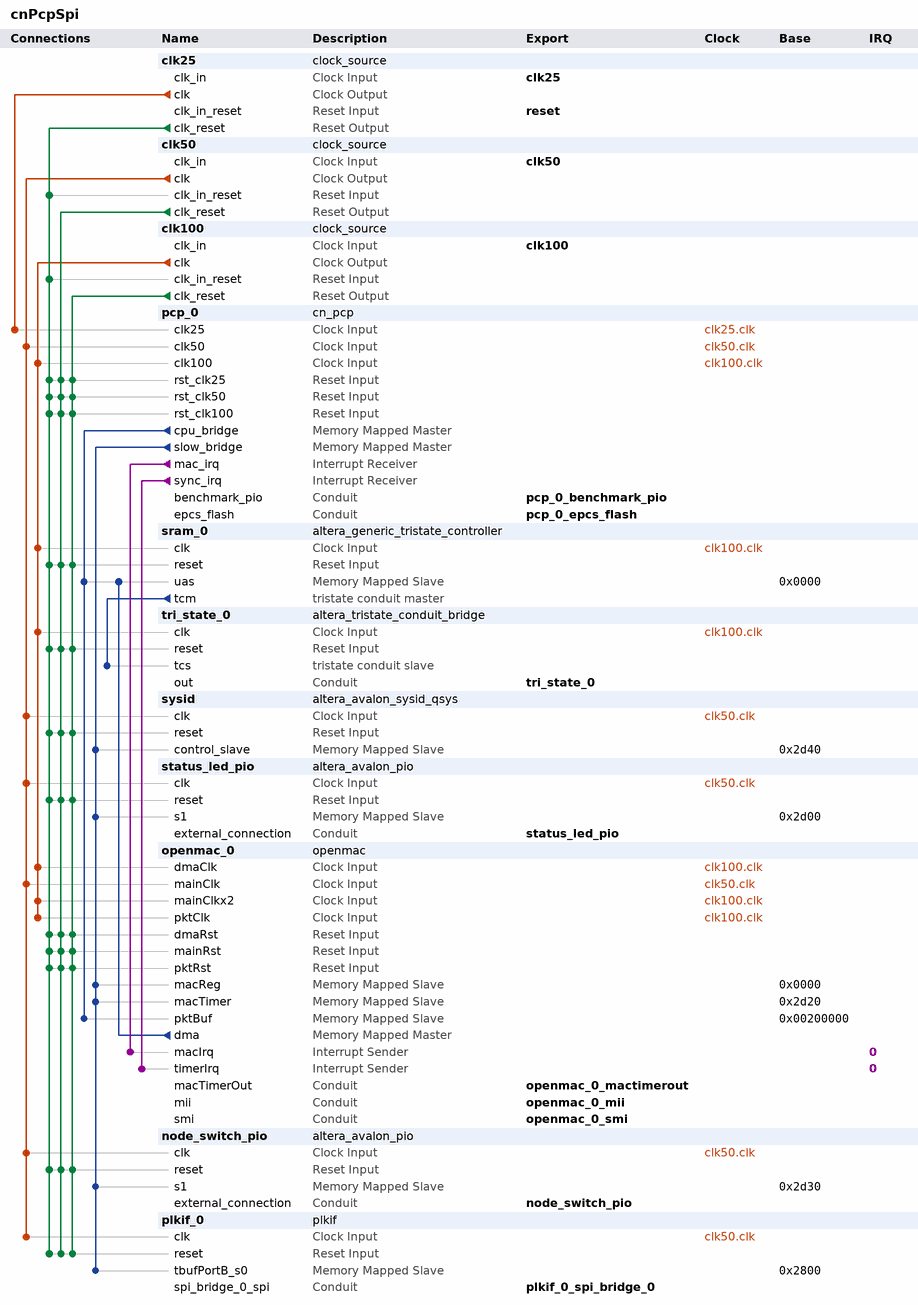
[diagram p0: system contents]
# Platform Designer (Qsys) system cnPcpSpi, Cyclone IV E EP4CE115F29C7
# Parameters at their usual value, and those the tool derives, are not listed.
package require -exact qsys 13.0
create_system cnPcpSpi
set_project_property DEVICE_FAMILY {Cyclone IV E}
set_project_property DEVICE EP4CE115F29C7

add_instance clk25 clock_source 13.0
set_instance_parameter_value clk25 clockFrequency 25000000

add_instance clk50 clock_source 13.0
set_instance_parameter_value clk50 clockFrequency 50000000

add_instance clk100 clock_source 13.0
set_instance_parameter_value clk100 clockFrequency 100000000

add_instance pcp_0 cn_pcp 1.0

add_instance sram_0 altera_generic_tristate_controller 13.0
set_instance_parameter_value sram_0 TCM_ADDRESS_W 21
set_instance_parameter_value sram_0 TCM_DATA_W 16
set_instance_parameter_value sram_0 TCM_BYTEENABLE_W 2
set_instance_parameter_value sram_0 TCM_READ_WAIT 1
set_instance_parameter_value sram_0 TCM_WRITE_WAIT 0
set_instance_parameter_value sram_0 TCM_SETUP_WAIT 0
set_instance_parameter_value sram_0 TCM_DATA_HOLD 0
set_instance_parameter_value sram_0 TCM_MAX_PENDING_READ_TRANSACTIONS 1
set_instance_parameter_value sram_0 TCM_TURNAROUND_TIME 1
set_instance_parameter_value sram_0 TCM_TIMING_UNITS 1
set_instance_parameter_value sram_0 TCM_READLATENCY 2
set_instance_parameter_value sram_0 TCM_SYMBOLS_PER_WORD 2
set_instance_parameter_value sram_0 USE_READ 1
set_instance_parameter_value sram_0 USE_BEGINTRANSFER 0
set_instance_parameter_value sram_0 USE_BYTEENABLE 1
set_instance_parameter_value sram_0 USE_OUTPUTENABLE 0
set_instance_parameter_value sram_0 ACTIVE_LOW_READ 1
set_instance_parameter_value sram_0 ACTIVE_LOW_BYTEENABLE 1
set_instance_parameter_value sram_0 ACTIVE_LOW_OUTPUTENABLE 0
set_instance_parameter_value sram_0 ACTIVE_LOW_BEGINTRANSFER 0
set_instance_parameter_value sram_0 CHIPSELECT_THROUGH_READLATENCY 0
set_instance_parameter_value sram_0 MODULE_ASSIGNMENT_KEYS embeddedsw.CMacro.SIZE
set_instance_parameter_value sram_0 MODULE_ASSIGNMENT_VALUES 2097152

add_instance tri_state_0 altera_tristate_conduit_bridge 13.0

add_instance sysid altera_avalon_sysid_qsys 13.0
set_instance_parameter_value sysid id 0

add_instance status_led_pio altera_avalon_pio 13.0.1.99.2
set_instance_parameter_value status_led_pio bitModifyingOutReg true
set_instance_parameter_value status_led_pio direction Output
set_instance_parameter_value status_led_pio width 2

add_instance openmac_0 openmac 1.0.0
set_instance_parameter_value openmac_0 gui_phyType 2
set_instance_parameter_value openmac_0 gui_phyCount 2
set_instance_parameter_value openmac_0 gui_extraSmi true
set_instance_parameter_value openmac_0 gui_txBufLoc 1
set_instance_parameter_value openmac_0 gui_txBufSize 7
set_instance_parameter_value openmac_0 gui_txBurstSize 1
set_instance_parameter_value openmac_0 gui_rxBurstSize 4
set_instance_parameter_value openmac_0 gui_tmrCount 2
set_instance_parameter_value openmac_0 gui_tmrPulseEn true
set_instance_parameter_value openmac_0 gui_actEn false
set_instance_parameter_value openmac_0 gui_sdcEn true

add_instance node_switch_pio altera_avalon_pio 13.0.1.99.2
set_instance_parameter_value node_switch_pio direction Input
set_instance_parameter_value node_switch_pio width 8

add_instance plkif_0 plkif 0.1
set_instance_parameter_value plkif_0 gDemoCfg cn-gpio
set_instance_parameter_value plkif_0 numOfCon 1
set_instance_parameter_value plkif_0 conBufSize0 12
set_instance_parameter_value plkif_0 conBufSize1 12
set_instance_parameter_value plkif_0 conBufSize2 3
set_instance_parameter_value plkif_0 conBufSize3 4
set_instance_parameter_value plkif_0 conBufSize4 5
set_instance_parameter_value plkif_0 conBufSize5 0
set_instance_parameter_value plkif_0 conBufSize6 0
set_instance_parameter_value plkif_0 conBufSize7 0
set_instance_parameter_value plkif_0 conBufSize8 0
set_instance_parameter_value plkif_0 conBufSize9 0
set_instance_parameter_value plkif_0 conBufSize10 0
set_instance_parameter_value plkif_0 conBufSize11 0
set_instance_parameter_value plkif_0 conBufSize12 0
set_instance_parameter_value plkif_0 conBufSize13 0
set_instance_parameter_value plkif_0 conBufSize14 0
set_instance_parameter_value plkif_0 conBufSize15 0
set_instance_parameter_value plkif_0 conBufSize16 0
set_instance_parameter_value plkif_0 conBufSize17 0
set_instance_parameter_value plkif_0 conBufSize18 0
set_instance_parameter_value plkif_0 conBufSize19 0
set_instance_parameter_value plkif_0 conBufSize20 0
set_instance_parameter_value plkif_0 conBufSize21 0
set_instance_parameter_value plkif_0 conBufSize22 0
set_instance_parameter_value plkif_0 conBufSize23 0
set_instance_parameter_value plkif_0 conBufSize24 0
set_instance_parameter_value plkif_0 conBufSize25 0
set_instance_parameter_value plkif_0 conBufSize26 0
set_instance_parameter_value plkif_0 conBufSize27 0
set_instance_parameter_value plkif_0 conBufSize28 0
set_instance_parameter_value plkif_0 conBufSize29 0
set_instance_parameter_value plkif_0 conBufSize30 0
set_instance_parameter_value plkif_0 conBufSize31 0
set_instance_parameter_value plkif_0 numOfPro 1
set_instance_parameter_value plkif_0 proBufSize0 4
set_instance_parameter_value plkif_0 proBufSize1 0
set_instance_parameter_value plkif_0 proBufSize2 0
set_instance_parameter_value plkif_0 proBufSize3 0
set_instance_parameter_value plkif_0 proBufSize4 0
set_instance_parameter_value plkif_0 proBufSize5 0
set_instance_parameter_value plkif_0 proBufSize6 0
set_instance_parameter_value plkif_0 proBufSize7 0
set_instance_parameter_value plkif_0 proBufSize8 0
set_instance_parameter_value plkif_0 proBufSize9 0
set_instance_parameter_value plkif_0 proBufSize10 0
set_instance_parameter_value plkif_0 proBufSize11 0
set_instance_parameter_value plkif_0 proBufSize12 0
set_instance_parameter_value plkif_0 proBufSize13 0
set_instance_parameter_value plkif_0 proBufSize14 0
set_instance_parameter_value plkif_0 proBufSize15 0
set_instance_parameter_value plkif_0 proBufSize16 0
set_instance_parameter_value plkif_0 proBufSize17 0
set_instance_parameter_value plkif_0 proBufSize18 0
set_instance_parameter_value plkif_0 proBufSize19 0
set_instance_parameter_value plkif_0 proBufSize20 0
set_instance_parameter_value plkif_0 proBufSize21 0
set_instance_parameter_value plkif_0 proBufSize22 0
set_instance_parameter_value plkif_0 proBufSize23 0
set_instance_parameter_value plkif_0 proBufSize24 0
set_instance_parameter_value plkif_0 proBufSize25 0
set_instance_parameter_value plkif_0 proBufSize26 0
set_instance_parameter_value plkif_0 proBufSize27 0
set_instance_parameter_value plkif_0 proBufSize28 0
set_instance_parameter_value plkif_0 proBufSize29 0
set_instance_parameter_value plkif_0 proBufSize30 0
set_instance_parameter_value plkif_0 proBufSize31 0
set_instance_parameter_value plkif_0 gConCfg spi
set_instance_parameter_value plkif_0 gui_cpol 0
set_instance_parameter_value plkif_0 gui_cpha 0
set_instance_parameter_value plkif_0 gui_shiftdir 1
set_instance_parameter_value plkif_0 gui_regsize 8

# connections
add_connection clk25.clk pcp_0.clk25 clock
add_connection clk50.clk node_switch_pio.clk clock
add_connection clk50.clk openmac_0.mainClk clock
add_connection clk50.clk pcp_0.clk50 clock
add_connection clk50.clk plkif_0.clk clock
add_connection clk50.clk status_led_pio.clk clock
add_connection clk50.clk sysid.clk clock
add_connection clk100.clk openmac_0.dmaClk clock
add_connection clk100.clk openmac_0.mainClkx2 clock
add_connection clk100.clk openmac_0.pktClk clock
add_connection clk100.clk pcp_0.clk100 clock
add_connection clk100.clk sram_0.clk clock
add_connection clk100.clk tri_state_0.clk clock
add_connection clk25.clk_reset clk50.clk_in_reset reset
add_connection clk25.clk_reset clk100.clk_in_reset reset
add_connection clk25.clk_reset node_switch_pio.reset reset
add_connection clk25.clk_reset openmac_0.dmaRst reset
add_connection clk25.clk_reset openmac_0.mainRst reset
add_connection clk25.clk_reset openmac_0.pktRst reset
add_connection clk25.clk_reset pcp_0.rst_clk25 reset
add_connection clk25.clk_reset pcp_0.rst_clk50 reset
add_connection clk25.clk_reset pcp_0.rst_clk100 reset
add_connection clk25.clk_reset plkif_0.reset reset
add_connection clk25.clk_reset sram_0.reset reset
add_connection clk25.clk_reset status_led_pio.reset reset
add_connection clk25.clk_reset sysid.reset reset
add_connection clk25.clk_reset tri_state_0.reset reset
add_connection clk50.clk_reset node_switch_pio.reset reset
add_connection clk50.clk_reset openmac_0.dmaRst reset
add_connection clk50.clk_reset openmac_0.mainRst reset
add_connection clk50.clk_reset openmac_0.pktRst reset
add_connection clk50.clk_reset pcp_0.rst_clk25 reset
add_connection clk50.clk_reset pcp_0.rst_clk50 reset
add_connection clk50.clk_reset pcp_0.rst_clk100 reset
add_connection clk50.clk_reset plkif_0.reset reset
add_connection clk50.clk_reset sram_0.reset reset
add_connection clk50.clk_reset status_led_pio.reset reset
add_connection clk50.clk_reset sysid.reset reset
add_connection clk50.clk_reset tri_state_0.reset reset
add_connection clk100.clk_reset node_switch_pio.reset reset
add_connection clk100.clk_reset openmac_0.dmaRst reset
add_connection clk100.clk_reset openmac_0.mainRst reset
add_connection clk100.clk_reset openmac_0.pktRst reset
add_connection clk100.clk_reset pcp_0.rst_clk25 reset
add_connection clk100.clk_reset pcp_0.rst_clk50 reset
add_connection clk100.clk_reset pcp_0.rst_clk100 reset
add_connection clk100.clk_reset plkif_0.reset reset
add_connection clk100.clk_reset sram_0.reset reset
add_connection clk100.clk_reset status_led_pio.reset reset
add_connection clk100.clk_reset sysid.reset reset
add_connection clk100.clk_reset tri_state_0.reset reset
add_connection openmac_0.dma sram_0.uas avalon
set_connection_parameter_value openmac_0.dma/sram_0.uas baseAddress 0x0000
add_connection pcp_0.cpu_bridge openmac_0.pktBuf avalon
set_connection_parameter_value pcp_0.cpu_bridge/openmac_0.pktBuf baseAddress 0x00200000
add_connection pcp_0.cpu_bridge sram_0.uas avalon
set_connection_parameter_value pcp_0.cpu_bridge/sram_0.uas baseAddress 0x0000
add_connection pcp_0.slow_bridge node_switch_pio.s1 avalon
set_connection_parameter_value pcp_0.slow_bridge/node_switch_pio.s1 baseAddress 0x2d30
add_connection pcp_0.slow_bridge openmac_0.macReg avalon
set_connection_parameter_value pcp_0.slow_bridge/openmac_0.macReg baseAddress 0x0000
add_connection pcp_0.slow_bridge openmac_0.macTimer avalon
set_connection_parameter_value pcp_0.slow_bridge/openmac_0.macTimer baseAddress 0x2d20
add_connection pcp_0.slow_bridge plkif_0.tbufPortB_s0 avalon
set_connection_parameter_value pcp_0.slow_bridge/plkif_0.tbufPortB_s0 baseAddress 0x2800
add_connection pcp_0.slow_bridge status_led_pio.s1 avalon
set_connection_parameter_value pcp_0.slow_bridge/status_led_pio.s1 baseAddress 0x2d00
add_connection pcp_0.slow_bridge sysid.control_slave avalon
set_connection_parameter_value pcp_0.slow_bridge/sysid.control_slave baseAddress 0x2d40
add_connection pcp_0.mac_irq openmac_0.macIrq interrupt
set_connection_parameter_value pcp_0.mac_irq/openmac_0.macIrq irqNumber 0
add_connection pcp_0.sync_irq openmac_0.timerIrq interrupt
set_connection_parameter_value pcp_0.sync_irq/openmac_0.timerIrq irqNumber 0
add_connection sram_0.tcm tri_state_0.tcs tristate_conduit

# exported interfaces
add_interface clk50 clock sink
set_interface_property clk50 EXPORT_OF clk50.clk_in
add_interface clk100 clock sink
set_interface_property clk100 EXPORT_OF clk100.clk_in
add_interface node_switch_pio conduit end
set_interface_property node_switch_pio EXPORT_OF node_switch_pio.external_connection
add_interface status_led_pio conduit end
set_interface_property status_led_pio EXPORT_OF status_led_pio.external_connection
add_interface clk25 clock sink
set_interface_property clk25 EXPORT_OF clk25.clk_in
add_interface pcp_0_benchmark_pio conduit end
set_interface_property pcp_0_benchmark_pio EXPORT_OF pcp_0.benchmark_pio
add_interface reset reset sink
set_interface_property reset EXPORT_OF clk25.clk_in_reset
add_interface tri_state_0 conduit end
set_interface_property tri_state_0 EXPORT_OF tri_state_0.out
add_interface plkif_0_spi_bridge_0 conduit end
set_interface_property plkif_0_spi_bridge_0 EXPORT_OF plkif_0.spi_bridge_0_spi
add_interface openmac_0_mii conduit end
set_interface_property openmac_0_mii EXPORT_OF openmac_0.mii
add_interface openmac_0_smi conduit end
set_interface_property openmac_0_smi EXPORT_OF openmac_0.smi
add_interface openmac_0_mactimerout conduit end
set_interface_property openmac_0_mactimerout EXPORT_OF openmac_0.macTimerOut
add_interface pcp_0_epcs_flash conduit end
set_interface_property pcp_0_epcs_flash EXPORT_OF pcp_0.epcs_flash

set_interconnect_requirement {$system} qsys_mm.clockCrossingAdapter HANDSHAKE
set_interconnect_requirement {$system} qsys_mm.maxAdditionalLatency 1

save_system cnPcpSpi.qsys
